# EasyEDA Pro project lceda_pro_3plus_2.5.epro, board pcb_main_4
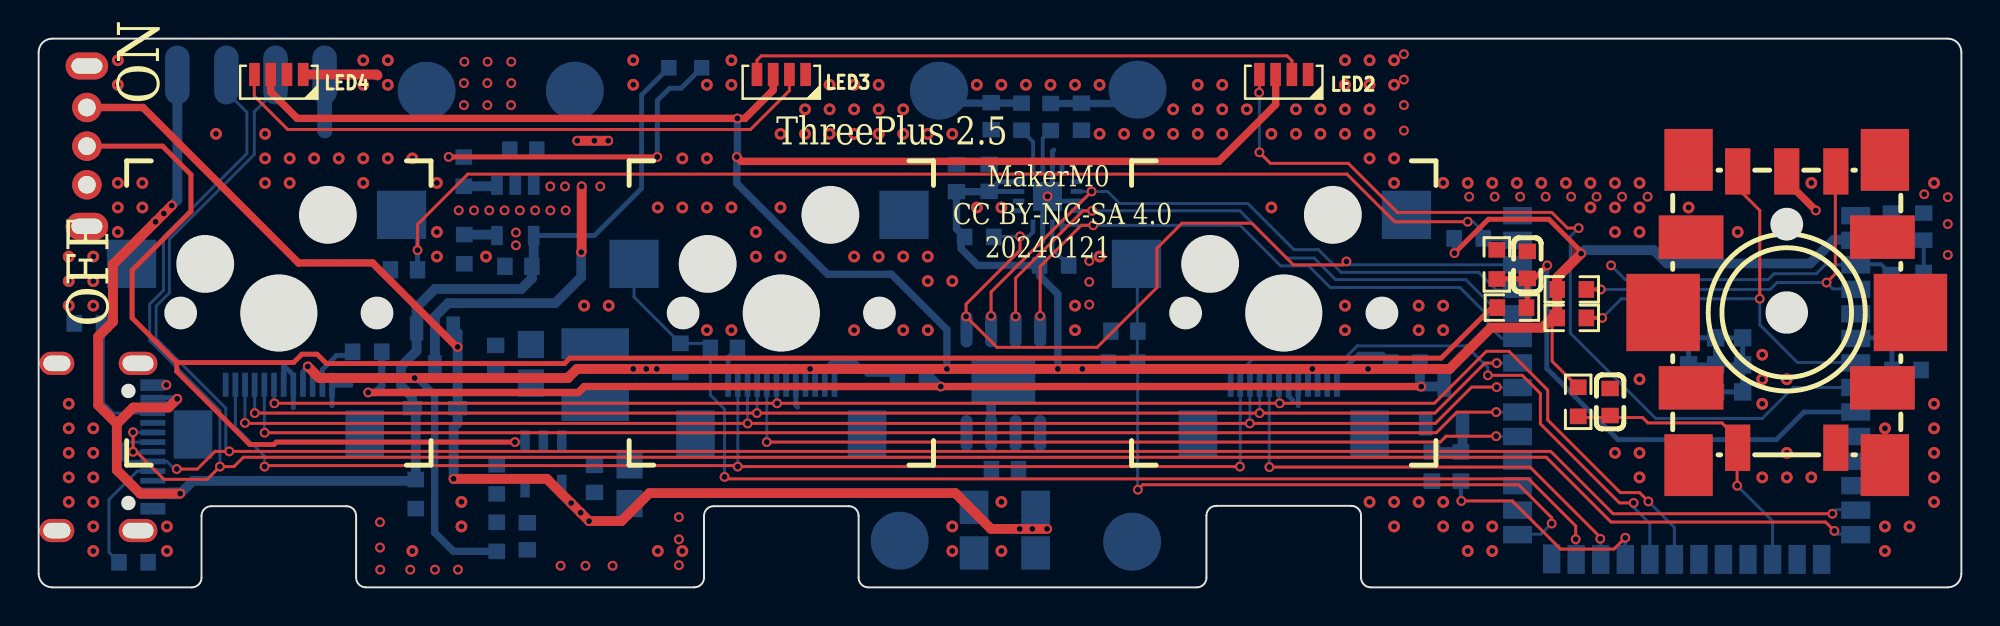
[diagram p1: board, top side]
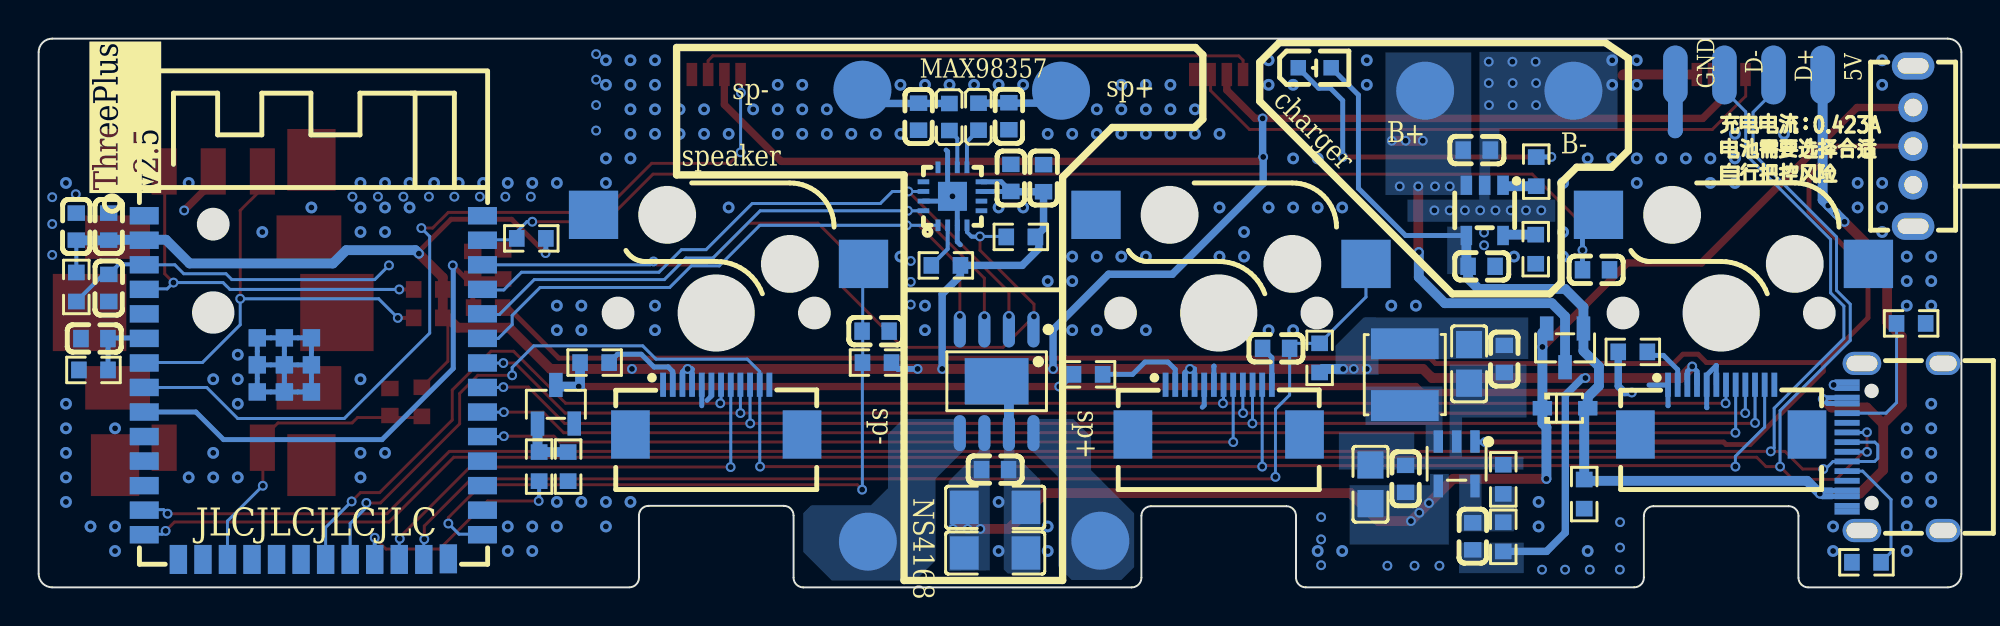
[diagram p2: board, bottom side, seen from below]

Outline 99.49 x 28.4 mm; copper layers: Top Layer, Bottom Layer. Coordinates in mm from the lower left corner of the outline.
Outline path: 0,27.7 arc(0.21,28.2) 0.7,28.4 98.79,28.4 arc(99.29,28.2) 99.49,27.7 99.49,0.7 arc(99.29,0.21) 98.79,0 68.93,0 arc(68.57,0.15) 68.43,0.5 68.43,3.72 arc(68.28,4.07) 67.93,4.22 60.93,4.22 arc(60.57,4.07) 60.43,3.72 60.43,0.5 arc(60.28,0.15) 59.93,0 42.93,0 arc(42.57,0.15) 42.43,0.5 42.43,3.7 arc(42.28,4.05) 41.93,4.2 34.93,4.2 arc(34.57,4.05) 34.43,3.7 34.43,0.5 arc(34.28,0.15) 33.93,0 16.93,0 arc(16.57,0.15) 16.43,0.5 16.43,3.7 arc(16.28,4.05) 15.93,4.2 8.93,4.2 arc(8.57,4.05) 8.43,3.7 8.43,0.5 arc(8.28,0.15) 7.93,0 0.7,0 arc(0.21,0.21) 0,0.7 0,27.7
Stack: Top Layer 0.035mm / Dielectric1 1.51mm FR4 er 4.5 / Bottom Layer 0.035mm

## Design rules (mm)
spacing safeClearance (default): track to track 0.152, other pairs 0.152 to 0.3
track width trackWidth (default): min 0.127, default 0.254, max 2.54
differential pair differentialPair (default): width min 0.127, default 0.254, max 2.54; gap min 0.152, default 0.152
via viaSize (default): diameter min 0.5, default 0.61, max 10; hole min 0.3, default 0.305, max 6

## Placement (name value [footprint] x y rotation side)
C4  100nF  [C0603]  95.87 18.67 270 bottom
C5  100nF  [C0603]  18.91 16.44 0 bottom
C6  10uF  [C0603]  97.54 18.67 270 bottom
C7  100nF  [C0603]  35.46 12.37 180 bottom
C8  100nF  [C0603]  56.18 13.26 0 bottom
C9  100nF  [C0603]  81.31 9.59 270 top
C10  10uF  [C0603]  25.08 22.63 0 bottom
C11  10uF  [C0603]  24.83 16.62 0 bottom
C34  10uF  [C0603]  47.49 21.18 270 bottom
C35  100nF  [C0603]  49.18 21.19 90 bottom
C47  680pF  [C0603]  49.29 24.39 90 bottom
C48  680pF  [C0603]  53.96 24.36 270 bottom
C204  1uF  [C0603]  95.86 15.5 90 bottom
C205  1uF  [C0603]  96.6 12.88 180 bottom
C206  100nF  [C0603]  28.76 5.62 270 bottom
C207  22uF  [C0805]  30.58 5.34 270 bottom
C208  22pF  [C0603]  25.28 2.64 270 bottom
C209  100nF  [C0603]  23.65 11.82 90 bottom
C210  22uF  [C0805]  25.47 11.57 90 bottom
C211  100nF  [C0603]  77.03 16.69 270 top
C213  1uF  [C0603]  50 6.1 0 bottom
C214  47uF  [C1206]  49.99 4.14 0 bottom
C215  47uF  [C1206]  49.99 1.78 0 bottom
D1  -  [sod-323_l1.8-w1.3-ls2.5-rd]  20.51 9.27 180 bottom
FPC1  FPC-05F-12PH20  [FPC-SMD_12P-P0.50_FPC-05F-12PH20]  12.43 9.2 180 bottom
FPC2  FPC-05F-12PH20  [FPC-SMD_12P-P0.50_FPC-05F-12PH20]  38.43 9.2 180 bottom
FPC3  FPC-05F-12PH20  [FPC-SMD_12P-P0.50_FPC-05F-12PH20]  64.43 9.2 180 bottom
L3  BLM18SG331TN1D  [L0603]  52.36 24.34 90 bottom
L4  BLM18SG331TN1D  [L0603]  50.86 24.36 90 bottom
L5  2.2uH  [IND-SMD_L4.0-W4.0]  28.8 11.01 270 bottom
LED1  -  [LED0603-R-RD]  33.46 26.89 180 bottom
LED2  XL-4020RGBC-WS2812B  [LED-SMD_4P-L4.0-W1.7_M4020-03003-RGB-862-001]  64.43 26.55 180 top
LED3  XL-4020RGBC-WS2812B  [LED-SMD_4P-L4.0-W1.7_M4020-03003-RGB-862-001]  38.43 26.55 180 top
LED4  XL-4020RGBC-WS2812B  [LED-SMD_4P-L4.0-W1.7_M4020-03003-RGB-862-001]  12.43 26.55 180 top
MX1  CPG151101S11-16  [CherryMX(KHS)-1.00U]  12.43 14.2 0 top
MX2  CPG151101S11-16  [CherryMX(KHS)-1.00U]  38.43 14.2 0 top
MX3  CPG151101S11-16  [CherryMX(KHS)-1.00U]  64.43 14.2 0 top
NOREF  -  [Pad_e276]  44.55 2.41 0 top
NOREF#2  -  [Pad_e277]  56.58 2.36 0 top
NOREF#3  -  [Pad_e3529]  20.07 25.71 270 top
NOREF#4  -  [Pad_e413]  7.18 26.52 0 top
NOREF#5  -  [Pad_e11]  12.26 26.52 0 top
NOREF#6  -  [Pad_e411]  9.72 26.52 0 top
NOREF#7  -  [Pad_e14]  14.8 26.52 0 top
NOREF#8  -  [Pad_e1487]  56.86 25.76 0 top
NOREF#9  -  [Pad_e1486]  46.59 25.71 0 top
NOREF#10  -  [Pad_e3530]  27.74 25.71 270 top
Q1  -  [SOT-23-3_L2.9-W1.3-P1.90-LS2.4-BR]  20.51 12.4 90 bottom
Q200  -  [SOT-23-3_L2.9-W1.3-P1.90-LS2.4-BR]  72.73 9.48 270 bottom
R1  5.1kΩ  [R0603]  4.91 1.3 0 bottom
R2  5.1kΩ  [R0603]  2.6 13.66 180 bottom
R3  10kΩ  [R0603]  74 18.06 180 bottom
R5  10kΩ  [R0603]  97.54 15.55 90 bottom
R7  10kΩ  [R0603]  33.21 11.88 270 bottom
R8  10kΩ  [R0603]  56.11 11.63 180 bottom
R9  10kΩ  [R0603]  79.33 13.95 0 top
R10  10kΩ  [R0603]  79.33 15.42 0 top
R11  10kΩ  [R0603]  79.66 9.6 90 top
R13  100kΩ  [R0603]  19.51 4.83 270 bottom
R16  1kΩ  [R0603]  22 21.52 90 bottom
R42  634kΩ  [R0603]  48.67 18.14 180 bottom
R43  100kΩ  [R0603]  52.55 16.66 180 bottom
R201  1kΩ  [R0603]  73.59 6.25 90 bottom
R202  10kΩ  [R0603]  72.09 6.25 90 bottom
R204  1MΩ  [R0603]  96.65 11.25 180 bottom
R205  20Ω  [R0603]  17 12.19 180 bottom
R206  20Ω  [R0603]  45.19 11.03 180 bottom
R207  20Ω  [R0603]  70.72 11.63 180 bottom
R208  1.5kΩ  [R0603]  22.02 17.5 90 bottom
R209  100kΩ  [R0603]  23.7 2.62 270 bottom
R211  22.1kΩ  [R0603]  23.7 5.59 270 bottom
R214  100kΩ  [R0603]  76.23 14.48 180 top
R215  100kΩ  [R0603]  75.45 16.72 270 top
SW102  EC11J1524413  [SW-SMD_EC11J1524413]  90.46 14.23 180 top
SW111  SK12D07VG4  [SW-TH_SK12D07VG4]  2.5 22.84 90 bottom
U1  -  [sot-23-5_l3.0-w1.7-p0.95-ls2.8-br]  24.67 19.51 90 bottom
U15  MAX98357AETE+T  [TQFN-16_L3.0-W3.0-P0.50-BL-EP1.5]  52.21 20.24 180 bottom
U205  ESP32-S3-WROOM-1-N8R2  [WIRELM-SMD_ESP32-S3-WROOM-1]  85.28 10.34 180 bottom
U206  SY8088IAAC  [SOT-23-5_L3.0-W1.7-P0.95-LS2.8-BL]  26.12 6.4 0 bottom
U207  NS4168  [ESOP-8_L4.9-W3.9-P1.27-LS6.0-BL-EP-1]  49.92 10.67 0 bottom
USB2  -  [USB-C_SMD-TYPE-C-31-M-12]  3.43 7.27 90 bottom

## Footprints (pads in the part's own frame, mm; a bottom-side part is the same pattern mirrored in y, then rotated)
C0603
  rect 0.8x0.9 smd: 1(-0.7,0) 2(0.7,0)
C0805
  rect 1.41x1.35 smd: 1(-1,0) 2(1,0)
C1206
  rect 1.485x1.728 smd: 1(-1.593,0) 2(1.593,0)
CherryMX(KHS)-1.00U
  rect 2.55x2.499 smd far side: COL(-7.62,2.54) ROW(6.35,5.08)
ESOP-8_L4.9-W3.9-P1.27-LS6.0-BL-EP-1
  oval 0.63x1.865 smd: 1(-1.905,-2.683) 2(-0.635,-2.683) 3(0.635,-2.683) 4(1.905,-2.683) 5(1.905,2.683) 6(0.635,2.683) 7(-0.635,2.683) 8(-1.905,2.683)
  rect 3.3x2.4 smd: 9(0,0)
FPC-SMD_12P-P0.50_FPC-05F-12PH20
  rect 0.3x1.25 smd: 1(-2.75,1.288) 2(-2.25,1.288) 3(-1.75,1.288) 4(-1.25,1.288) 5(-0.75,1.288) 6(-0.25,1.288) 7(0.25,1.288) 8(0.75,1.288) 9(1.25,1.288) 10(1.75,1.288) 11(2.25,1.288) 12(2.75,1.288)
  rect 2x2.5 smd: 13(4.44,-1.288) 14(-4.44,-1.288)
IND-SMD_L4.0-W4.0
  rect 1.6x3.5 smd: 1(-1.6,0) 2(1.6,0)
L0603
  rect 0.8x0.864 smd: 1(-0.7,0) 2(0.7,0)
LED0603-R-RD
  rect 0.8x0.8 smd: 1(0.851,0) 2(-0.851,0)
LED-SMD_4P-L4.0-W1.7_M4020-03003-RGB-862-001
  rect 0.55x1.2 smd: 1(-1.26,0) 2(-0.42,0) 3(0.42,0) 4(1.26,0)
Pad_e11
  oval 1.27x3.048 smd far side: 43(0,0)
Pad_e14
  oval 1.27x3.048 smd far side: 44(0,0)
Pad_e276
  round 3 smd far side: 1(0,0)
Pad_e277
  round 3 smd far side: 2(0,0)
Pad_e411
  oval 1.27x3.048 smd far side: 43(0,0)
Pad_e413
  oval 1.27x3.048 smd far side: 42(0,0)
Pad_e1486
  round 3 smd far side: 1(0,0)
Pad_e1487
  round 3 smd far side: 2(0,0)
Pad_e3529
  round 3 smd far side: 1(0,0)
Pad_e3530
  round 3 smd far side: 2(0,0)
R0603
  rect 0.806x0.864 smd: 1(-0.753,0) 2(0.753,0)
sod-323_l1.8-w1.3-ls2.5-rd
  rect 1.001x0.75 smd: 1(-1.173,0) 2(1.173,0)
SOT-23-3_L2.9-W1.3-P1.90-LS2.4-BR
  rect 1.25x0.701 smd: 1(1.001,-0.95) 2(1.001,0.95) 3(-1.001,0)
SOT-23-5_L3.0-W1.7-P0.95-LS2.8-BL
  rect 0.49x1.157 smd: 1(-0.95,-1.153) 2(0,-1.153) 3(0.95,-1.153)
  rect 0.49x1.175 smd: 4(0.95,1.153) 5(-0.95,1.153)
sot-23-5_l3.0-w1.7-p0.95-ls2.8-br
  rect 1.001x0.6 smd: 1(1.3,-0.95) 2(1.3,0) 3(1.3,0.95) 4(-1.3,0.95) 5(-1.3,-0.95)
SW-SMD_EC11J1524413
  rect 1.3x2.4 smd: A(-2.54,-7.3) B(2.54,-7.3) C(0,-7.3) D(-2.54,7) E(2.54,7)
  rect 3.8x4 smd: EH(-6.4,0) EH(6.4,0)
  rect 2.5x3.2 smd: EH(-5.08,7.9) EH(-5.08,-7.9) EH(5.08,7.9) EH(5.08,-7.9)
  rect 3.35x2.25 smd: EH(-4.95,3.9) EH(-4.95,-3.9) EH(4.95,3.9) EH(4.95,-3.9)
SW-TH_SK12D07VG4
  round 1.524 hole 0.914: 1(-2,0) 2(0,0) 3(2,0)
  oval 1.4x2.2 hole 0.8x1.6: 4(4.15,0) 5(-4.15,0)
TQFN-16_L3.0-W3.0-P0.50-BL-EP1.5
  rect 0.25x0.6 smd: 1(-0.749,-1.5) 2(-0.248,-1.5) 3(0.252,-1.5) 4(0.751,-1.5) 9(0.75,1.5) 10(0.25,1.5) 11(-0.25,1.5) 12(-0.749,1.5)
  rect 0.6x0.25 smd: 5(1.5,-0.748) 6(1.5,-0.248) 7(1.5,0.252) 8(1.5,0.752) 13(-1.5,0.752) 14(-1.5,0.252) 15(-1.5,-0.248) 16(-1.5,-0.748)
  rect 1.5x1.5 smd: 17(0,0)
USB-C_SMD-TYPE-C-31-M-12
  oval 1.2x1.8 hole 0.8x1.4: 0(-4.325,-2.484) 0(4.325,-2.484)
  oval 1.2x2 hole 0.8x1.6: 0(-4.325,1.716) 0(4.325,1.716)
  rect 0.3x1.3 smd: A1(-3.35,2.484) A4(-2.55,2.484) A5(-1.25,2.484) A6(-0.25,2.484) A7(0.25,2.484) A8(1.25,2.484) A9(2.55,2.484) A12(3.35,2.484) B1(3.05,2.484) B4(2.25,2.484) B5(1.75,2.484) B6(0.75,2.484) B7(-0.75,2.484) B8(-1.75,2.484) B9(-2.25,2.484) B12(-3.05,2.484)
WIRELM-SMD_ESP32-S3-WROOM-1
  rect 1.5x0.9 smd: 1(-8.75,8.895) 2(-8.75,7.625) 3(-8.75,6.355) 4(-8.75,5.085) 5(-8.75,3.815) 6(-8.75,2.545) 7(-8.75,1.275) 8(-8.75,0.005) 9(-8.75,-1.265) 10(-8.75,-2.535) 11(-8.75,-3.805) 12(-8.75,-5.075) 13(-8.75,-6.345) 14(-8.75,-7.615) 27(8.75,-7.615) 28(8.75,-6.345) 29(8.75,-5.075) 30(8.75,-3.805) 31(8.75,-2.535) 32(8.75,-1.265) 33(8.75,0.005) 34(8.75,1.275) 35(8.75,2.545) 36(8.75,3.815) 37(8.75,5.085) 38(8.75,6.355) 39(8.75,7.625) 40(8.75,8.895)
  rect 0.9x1.5 smd: 15(-6.985,-8.895) 16(-5.715,-8.895) 17(-4.445,-8.895) 18(-3.175,-8.895) 19(-1.905,-8.895) 20(-0.635,-8.895) 21(0.635,-8.895) 22(1.905,-8.895) 23(3.175,-8.895) 24(4.445,-8.895) 25(5.715,-8.895) 26(6.985,-8.865)
  rect 0.9x0.9 smd: 41(-2.9,-0.225) 41(-2.9,1.175) 41(-2.9,2.575) 41(-1.5,-0.225) 41(-1.5,1.175) 41(-1.5,2.575) 41(-0.1,-0.225) 41(-0.1,1.175) 41(-0.1,2.575)

## Nets
As in the schematic, except:
GND: C4.1 C5.1 C6.1 C7.1 C8.1 C9.1 C10.1 C11.1 C34.1 C35.2 C47.1 C48.2 C204.1 C205.1 C206.1 C207.1 C209.1 C210.1 C211.1 C213.1 C214.1 C215.1 FPC1.1 FPC1.5 FPC1.6 FPC1.12 FPC1.13 FPC1.14 FPC2.1 FPC2.5 FPC2.6 FPC2.12 FPC2.13 FPC2.14 FPC3.1 FPC3.5 FPC3.6 FPC3.12 FPC3.13 FPC3.14 LED2.1 LED3.1 LED4.1 MX1.COL MX2.ROW MX3.ROW NOREF#3.1 NOREF#7.44 Q200.2 R1.2 R2.2 R13.2 R202.1 R204.1 R208.1 R211.1 R215.1 SW102.C SW102.D SW102.EH SW111.1 SW111.4 SW111.5 U1.2 U15.3 U15.11 U15.15 U15.17 U205.1 U205.40 U205.41 U206.2 U207.7 U207.9 USB2.0 USB2.A1 USB2.A12 USB2.B1 USB2.B12
VBAT: C10.2 NOREF#10.2 Q1.3 U1.3
NS_N: NOREF#2.2 U207.5
NS_P: NOREF.1 U207.8
USBDM: NOREF#5.43 U205.13 USB2.A7 USB2.B7
USBDP: NOREF#6.43 U205.14 USB2.A6 USB2.B6
VON: C48.1 L3.2 NOREF#8.2
VOP: C47.2 L4.2 NOREF#9.1
VUSB: C11.2 D1.2 LED1.1 NOREF#4.42 Q1.1 R13.1 U1.4 USB2.A4 USB2.A9 USB2.B4 USB2.B9

Pads without a net: U15 5 6 12 13; U205 5 10 11 12 15 16 18 19 20 26 28 29 30; USB2 A8 B8

## Via types
v1: diameter 0.508, hole 0.305, Top Layer to Bottom Layer, 152 vias
v2: diameter 0.61, hole 0.305, Top Layer to Bottom Layer, 196 vias

## Routing (per net, layer and track width the routed paths; a pad name or vN(x,y) marks a point on that pad's centre or on a via; arc(x,y) is an arc through that point)
GND: length 47.3
  Top Layer w0.381: 90.43,21.5 90.43,21.04 v1(91.96,19.51)
  Top Layer w0.508: 17.53,26.49 17.48,26.55 LED4.1
  Bottom Layer w0.254: U15.15 52.45,19.99 ; 39.18,10.47 39.18,9.42 39.28,9.32 ; U205.41 U205.41 U205.41 ; U205.41 U205.41 ; U205.41 U205.41 U205.41 ; U205.41 U205.41 ; U205.41 U205.41 ; U205.41 U205.41 ; 51.8,17.73 51.95,17.89 U15.3 51.95,19.99 v1(52.21,20.24) 52.46,20.49 U15.11 52.46,22.55 52.53,22.63 ; U205.41 U205.41 U205.41 ; U205.41 U205.41 U205.41 ; 15.17,9.4 15.18,9.41 15.18,10.47 16.16,10.47 ; C7.1 35.68,11.89 35.68,10.49 ; 64.9,9.68 64.68,9.91 64.68,10.47 ; 38.68,10.47 38.68,11.45 38.67,11.46 ; 65.18,10.47 65.18,9.4 ; 13.16,9.3 13.18,9.31 13.18,10.99 12.68,11.48 12.68,11.48 12.68,10.47
  Bottom Layer w0.508: U207.7 49.28,10.03 U207.9
  Bottom Layer w0.762: 14.82,23.62 14.8,23.64 NOREF#7.44
  vias: v1(6.61,10.48) v1(17.66,3.37) v1(17.66,2.06) v1(17.67,0.92) v1(19.23,0.92) v1(20.51,0.92) v1(21.7,0.92) v1(21.74,19.51) v1(22.01,26.1) v1(22.01,24.96) v1(22.03,27.21) v1(22.53,19.51) v1(23.23,27.21) v1(23.22,26.1) v1(23.22,24.96) v1(23.32,19.51) v1(24.11,19.51) v1(24.45,27.21) v1(24.45,26.1) v1(24.44,24.96) v1(24.7,18.37) v1(24.7,17.71) v1(24.9,19.51) v1(25.69,19.51) v1(26.48,19.51) v1(27.01,1.12) v1(27.27,19.51) v1(28.29,1.12) v1(29.7,1.12) v1(33.13,3.63) v1(33.13,2.48) v1(33.13,1.14) v1(54.36,16.89) v1(54.36,15.81) v1(54.36,14.64) v1(70.65,27.6) v1(70.65,26.28) v1(70.65,24.96) v1(70.65,23.64) v1(74.02,20.22) v1(75.34,20.22) v1(76.66,20.22) v1(77.98,20.22) v1(79.3,20.22) v1(80.62,20.22) v1(81.93,20.22) v1(83.25,20.22) v1(97.57,20.35) v1(98.79,20.19) v1(98.79,18.8) v1(98.79,17.21) v2(1.56,17.12) v2(1.56,15.85) v2(1.56,14.58) v2(1.56,9.5) v2(1.56,8.23) v2(1.56,6.96) v2(1.56,5.69) v2(1.56,4.42) v2(2.83,17.12) v2(2.83,15.85) v2(2.83,14.58) v2(2.83,8.23) v2(2.83,6.96) v2(2.83,5.69) v2(2.83,4.42) v2(2.83,3.15) v2(2.83,1.88) v2(4.1,27.28) v2(4.1,26.01) v2(4.1,20.93) v2(4.1,19.66) v2(4.1,18.39) v2(5.37,20.93) v2(5.37,19.66) v2(6.64,3.15) v2(6.64,1.88) v2(9.18,23.47) v2(11.72,23.47) v2(11.72,22.2) v2(11.72,20.93) v2(12.99,22.2) v2(12.99,20.93) v2(14.26,22.2) v2(15.53,22.2) v2(16.8,27.28) v2(16.8,26.01) v2(16.8,22.2) v2(16.8,20.93) v2(18.07,27.28) v2(18.07,26.01) v2(18.07,22.2) v2(19.34,22.2) v2(19.34,1.88) v2(20.61,20.93) v2(20.61,18.39) v2(20.61,17.12) v2(21.88,4.42) v2(21.88,3.15) v2(23.15,17.12) v2(28.23,14.58) v2(29.5,14.58) v2(30.77,27.28) v2(30.77,26.01) v2(32.04,19.66) v2(32.04,1.88) v2(33.31,22.2) v2(33.31,19.66) v2(33.31,1.88) v2(34.58,26.01) v2(34.58,22.2) v2(34.58,19.66) v2(34.58,13.31) v2(35.85,27.28) v2(35.85,26.01) v2(35.85,19.66) v2(35.85,13.31) v2(37.12,18.39) v2(37.12,17.12) v2(38.39,23.47) v2(38.39,19.66) v2(38.39,17.12) v2(39.66,24.74) v2(39.66,23.47) v2(40.93,26.01) v2(40.93,24.74) v2(40.93,23.47) v2(42.2,26.01) v2(42.2,24.74) v2(42.2,23.47) v2(42.2,17.12) v2(42.2,13.31) v2(43.47,26.01) v2(43.47,24.74) v2(43.47,23.47) v2(43.47,17.12) v2(44.74,24.74) v2(44.74,23.47) v2(44.74,17.12) v2(44.74,13.31) v2(46.01,23.47) v2(46.01,17.12) v2(46.01,15.85) v2(46.01,13.31) v2(47.28,23.47) v2(47.28,15.85) v2(47.28,3.15) v2(47.28,1.88) v2(48.55,26.01) v2(48.55,19.66) v2(49.82,26.01) v2(49.82,19.66) v2(49.82,4.42) v2(49.82,1.88) v2(51.09,26.01) v2(52.36,26.01) v2(53.63,26.01) v2(53.63,14.58) v2(53.63,13.31) v2(54.9,26.01) v2(54.9,23.47) v2(54.9,17.12) v2(56.17,23.47) v2(57.44,23.47) v2(58.71,24.74) v2(58.71,23.47) v2(59.98,26.01) v2(59.98,24.74) v2(59.98,23.47) v2(61.25,26.01) v2(61.25,24.74) v2(61.25,23.47) v2(62.52,24.74) v2(63.79,23.47) v2(63.79,19.66) v2(65.06,24.74) v2(65.06,23.47) v2(66.33,24.74) v2(66.33,23.47) v2(67.6,27.28) v2(67.6,26.01) v2(67.6,24.74) v2(67.6,23.47) v2(67.6,14.58) v2(67.6,13.31) v2(68.87,27.28) v2(68.87,26.01) v2(68.87,24.74) v2(68.87,23.47) v2(68.87,22.2) v2(68.87,4.42) v2(70.14,27.28) v2(70.14,26.01) v2(70.14,22.2) v2(70.14,20.93) v2(70.14,4.42) v2(70.14,3.15) v2(71.41,14.58) v2(71.41,13.31) v2(71.41,4.42) v2(72.68,20.93) v2(72.68,14.58) v2(72.68,13.31) v2(72.68,4.42) v2(72.68,3.15) v2(73.95,20.93) v2(73.95,3.15) v2(73.95,1.88) v2(75.22,20.93) v2(75.22,3.15) v2(75.22,1.88) v2(76.49,20.93) v2(77.76,20.93) v2(79.03,20.93) v2(80.3,20.93) v2(80.3,19.66) v2(81.57,20.93) v2(81.57,19.66) v2(81.57,18.39) v2(81.57,6.96) v2(82.84,20.93) v2(82.84,19.66) v2(82.84,18.39) v2(82.84,10.77) v2(82.84,6.96) v2(82.84,5.69) v2(85.38,19.66) v2(87.92,18.39) v2(89.19,12.04) v2(89.19,10.77) v2(89.19,9.5) v2(89.19,5.69) v2(90.46,10.77) v2(90.46,6.96) v2(90.46,5.69) v2(91.73,20.93) v2(91.73,5.69) v2(95.54,8.23) v2(95.54,3.15) v2(95.54,1.88) v2(96.81,3.15) v2(98.08,20.93) v2(98.08,9.5) v2(98.08,8.23) v2(98.08,6.96) v2(98.08,5.69) v2(98.08,4.42)
VBAT: length 17.3
  Top Layer w0.508: v1(27.87,23.12) v1(28.76,23.12) v1(29.47,23.12) ; v1(28.1,20.75) 28.1,17.38 v1(28.07,17.35)
  Bottom Layer w0.508: 20.51,11.44 20.51,14.02 21.19,14.71 26.73,14.71 28.07,16.05 v1(28.07,17.35)
  vias: v1(26.47,20.75) v1(27.24,20.75) v1(29.06,20.75)
VCC: length 222.6
  Top Layer w0.152: R11.2 78.32,11.7 78.32,13.95 78.58,14.21
  Top Layer w0.254: v1(79.81,17.27) 79.81,17.38 78.15,19.05 75.01,19.05 v1(73.26,17.3)
  Top Layer w0.381: LED2.3 64.01,24.99 61.07,22.05 36.35,22.05 v1(36.13,22.28) ; LED3.3 38.01,25.73 36.55,24.27 v1(36.16,24.27) 13.38,24.27 12.01,25.64 LED4.3
  Top Layer w0.508: 27.39,10.84 v1(19.45,10.84) 14.52,10.84 v1(13.93,11.43) ; 27.39,10.84 27.39,10.88 ; 27.39,10.84 27.86,11.3 v1(30.77,11.3) v1(31.44,11.3) v1(31.99,11.3) v1(39.92,11.3) v1(47,11.3) v1(52.74,11.3) v1(54.01,11.3) v1(65.91,11.3) v1(68.79,11.3) 73.01,11.3 75.14,13.44 77.81,13.44 78.32,13.95 R9.1 R10.1 78.58,16.04 v1(79.81,17.27)
  Bottom Layer w0.203: 97.54,17.96 R5.2
  Bottom Layer w0.254: 66.18,10.47 66.18,11.15 66.05,11.28 65.69,11.28 65.68,11.29 ; U15.7 49.19,20.49 C35.1 49.68,20.99 U15.8 ; 13.68,10.47 13.68,11.18 v1(13.93,11.43) 14.18,11.18 14.18,10.47 ; R3.2 73.24,17.32 v1(73.26,17.3) ; 39.68,10.47 39.68,10.47 39.68,11.3 39.99,11.3 40.18,11.11 40.18,10.47 ; 65.68,11.29 65.68,10.47 ; 65.68,11.29 65.69,11.3 v1(65.91,11.3)
  Bottom Layer w0.305: v1(54.01,11.3) 55.03,11.3 R8.2
  Bottom Layer w0.381: R209.2 21.46,1.86 20.49,2.83 20.49,9.95 19.6,10.84 v1(19.45,10.84) ; 47.73,18.32 47.73,17.53 48.6,16.66 R43.2 51.79,16.13 52.74,15.18 v1(52.74,11.3) ; 47.73,18.32 R42.2 ; 47.73,18.32 47.49,18.56 C34.2 49.17,20.48 C35.1 ; v1(36.16,24.27) 36.16,22.31 v1(36.13,22.28) 36.13,20.91 40.83,16.21 44.13,16.21 47,13.34 v1(47,11.3)
  Bottom Layer w0.508: 97.54,17.96 95.75,17.96 95.72,17.99 92.9,17.99 91.68,16.77 84.26,16.77 83.57,17.45 79.99,17.45 v1(79.81,17.27) ; v1(31.99,11.3) 33.03,11.3 R7.2
ADC: length 27.9
  Top Layer w0.254: C211.2 77.03,14.52 R214.1 ; C211.2 77.01,15.97 75.46,15.97 R215.2 ; C211.2 77.39,15.99 v1(78.06,16.66)
  Bottom Layer w0.254: U205.9 91.35,9.08 89.92,7.65 81.72,7.65 78.04,11.33 78.04,16.64 v1(78.06,16.66)
AUDIO_SD: length 42.4
  Top Layer w0.152: v1(50.78,18.16) 50.78,17.45 47.99,14.66 v1(47.99,14.02) 49.59,12.42 54.77,12.42 57.87,15.52 57.87,17.55 59.16,18.85 62.77,18.85 64.93,16.69 67.5,16.69 v1(67.67,16.87)
  Bottom Layer w0.152: U205.38 67.85,16.69 v1(67.67,16.87) ; 51.23,18.16 51.2,18.14 50.76,18.14 v1(50.78,18.16) 49.45,18.16 R42.1
  Bottom Layer w0.203: U15.4 51.45,18.39 51.23,18.16 50.76,18.14
BOOT: length 36.2
  Top Layer w0.152: v1(78.29,3.3) 78.29,3.61 76.59,5.31 57.13,5.31 v1(56.88,5.06)
  Bottom Layer w0.152: v1(78.29,3.3) 77.74,2.75 76.53,2.75 ; MX3.COL 56.85,16.7 56.85,11.78 56.87,11.76 56.87,5.07 v1(56.88,5.06)
CC1: length 6.8
  Bottom Layer w0.152: R1.1 3.64,1.81 3.64,4.55 5.11,6.02 6.33,6.02
CC2: length 7.3
  Bottom Layer w0.152: 6.33,9.02 3.9,9.02 3.35,9.56 R2.1
EC_A: length 20.1
  Top Layer w0.152: v1(92.51,15.78) 92.97,16.23 92.97,21.5
  Top Layer w0.203: R10.2 v1(80.83,15.42)
  Bottom Layer w0.152: v1(80.83,15.42) 89.59,15.42 89.95,15.78 v1(92.51,15.78) 92.84,15.45 94.03,15.45
EC_B: length 23.6
  Top Layer w0.152: v1(89.06,14.94) 89.06,19.51 87.89,20.68 87.89,21.5
  Top Layer w0.203: R9.2 v1(80.91,13.95)
  Bottom Layer w0.152: v1(80.91,13.95) 81.9,14.94 v1(89.06,14.94) 89.06,13.59 91.01,11.64 94.03,11.64
EN: length 17.6
  Bottom Layer w0.152: v1(81.36,16.66) 82.1,15.93 89.49,15.93 89.8,16.23 91.98,16.23 92.44,16.69 U205.3
  Bottom Layer w0.203: 94.03,16.72 95.34,16.72 C204.2 96.14,16.2 R5.1
I2S_BCK: length 32.4
  Top Layer w0.152: v1(54.51,19.49) 54.04,19.49 50.55,16 v1(50.55,14.02)
  Bottom Layer w0.152: U15.16 v1(54.51,19.49) 62.15,19.49 64.6,17.05 66,17.05 67.11,15.93 73.85,15.93 75.65,14.12 76.5,14.12 U205.36
I2S_DATA: length 32.5
  Top Layer w0.152: v1(54.57,18.74) 53.95,18.74 51.82,16.61 v1(51.82,14.05)
  Bottom Layer w0.152: U205.35 75.7,12.88 74.99,13.6 74.99,14.07 73.54,15.52 66.84,15.52 65.72,16.64 64.27,16.64 62.17,18.74 v1(54.57,18.74) U15.1
I2S_WS: length 33.5
  Top Layer w0.152: v1(54.49,20.49) 49.28,15.29 v1(49.28,14.05)
  Bottom Layer w0.152: U15.14 v1(54.49,20.49) 55.31,20.49 55.94,19.86 62.57,19.86 64.96,17.48 66.23,17.48 67.39,16.31 74.51,16.31 75.42,15.39 76.5,15.39 U205.37
IO6: length 3.5
  Bottom Layer w0.254: 94.03,12.91 95.87,12.91 C205.2 95.9,12.88 R204.2
IO13: length 82.8
  Top Layer w0.152: v1(12.2,9.53) v1(38.21,9.53) v1(64.22,9.53) 72.22,9.53 74.91,12.22 76.08,12.22 78.09,10.21 78.09,8.66 81.85,4.9 82.84,4.9 v1(83.29,4.45)
  Bottom Layer w0.152: v1(83.29,4.45) 84.64,3.1 U205.21 ; 64.18,10.47 64.18,9.57 v1(64.22,9.53) ; v1(12.2,9.53) 12.18,9.55 12.18,10.47 ; v1(38.21,9.53) 38.18,9.56 38.18,10.47
IO14: length 93.2
  Top Layer w0.152: v1(11.69,6.25) 11.74,6.3 36.13,6.3 v1(36.18,6.25) v1(62.16,6.25) ; v1(82.53,4.37) 81.8,4.37 77.71,8.46 77.71,10.03 76.77,10.97 v1(74.99,10.97)
  Bottom Layer w0.152: 10.18,10.47 10.18,8.3 11.69,6.78 v1(11.69,6.25) ; 36.18,6.25 36.18,10.47 ; v1(62.16,6.25) 62.18,6.27 62.18,11.17 62.82,11.81 67.55,11.81 68.23,12.5 73.87,12.5 74.99,11.38 v1(74.99,10.97) ; U205.22 83.37,3.3 82.53,4.14 v1(82.53,4.37)
LCD_BL: length 11.9
  Top Layer w0.152: v1(82.1,2.57) 81.52,1.98 78.75,1.98 76.26,4.47 v1(73.62,4.47)
  Bottom Layer w0.203: v1(73.62,4.47) 73.59,4.5 R201.1 ; U205.23 v1(82.1,2.57)
LED: length 45.1
  Top Layer w0.152: v1(63.17,22.52) 63.74,21.95 67.77,21.95 70.31,19.41 78.29,19.41 79.11,18.59 v1(79.69,18.59) ; LED2.4 63.17,25.62 v1(63.15,25.6)
  Bottom Layer w0.152: v1(63.17,22.52) 63.17,25.59 v1(63.15,25.6) ; U205.8 90.79,10.34 89.19,8.74 83.67,8.74 79.26,13.16 79.26,18.16 v1(79.69,18.59)
LEDK: length 60.8
  Top Layer w0.381: v1(71.54,10.39) v1(46.68,10.39) 28.23,10.39 27.92,10.09 v1(17.05,10.09)
  Bottom Layer w0.254: 72.64,10.39 Q200.3
  Bottom Layer w0.381: R205.1 17.75,10.41 17.42,10.09 v1(17.05,10.09) ; v1(46.68,10.39) 46.05,11.03 R206.1
  Bottom Layer w0.508: R207.1 71.47,10.39 v1(71.54,10.39) 72.64,10.39
MOSI: length 72.6
  Top Layer w0.152: v1(10.68,8.51) 10.7,8.49 v1(36.69,8.49) v1(62.67,8.49) 72.27,8.49 74.15,10.36 v1(75.45,10.36)
  Bottom Layer w0.152: 10.68,10.47 10.68,10.47 v1(10.68,8.51) 10.68,8.46 ; 62.68,10.47 62.68,8.49 v1(62.67,8.49) ; U205.33 75.47,10.34 v1(75.45,10.36) ; v1(36.69,8.49) 36.68,8.49 36.68,10.47
OLED_CS1: length 67.8
  Top Layer w0.152: v1(11.69,8) 72.32,8 73.39,9.07 v1(75.42,9.07)
  Bottom Layer w0.152: v1(11.69,8) 11.68,8.02 11.68,10.47 ; U205.32 76.52,9.07 v1(75.42,9.07)
OLED_CS2: length 41.9
  Top Layer w0.152: v1(37.68,7.52) 72.52,7.52 72.83,7.83 v1(75.42,7.83)
  Bottom Layer w0.152: 37.68,10.47 37.68,7.52 v1(37.68,7.52) ; U205.31 75.44,7.8 v1(75.42,7.83)
OLED_CS3: length 24
  Top Layer w0.152: v1(63.69,6.22) 77.17,6.22 80.81,2.59 v1(80.81,2.52)
  Bottom Layer w0.152: v1(80.81,2.52) 80.83,2.49 U205.24 ; 63.68,10.47 63.68,6.23 v1(63.69,6.22)
SCLK: length 70.8
  Top Layer w0.152: v1(75.45,11.61) 74.84,11.61 72.25,9.02 v1(63.18,9.02) v1(37.17,9.02) v1(11.18,9.02)
  Bottom Layer w0.152: v1(11.18,9.02) 11.18,9.02 11.18,10.47 ; v1(75.45,11.61) 76.52,11.61 U205.34 ; 63.18,9.02 63.18,10.47 ; v1(37.17,9.02) 37.18,9.03 37.18,10.47
SW01: length 64.1
  Top Layer w0.152: v1(73.95,18.92) 70.16,18.92 67.7,21.39 22.21,21.39 19.6,18.79 v1(19.6,17.45)
  Bottom Layer w0.152: 76.53,17.99 74.82,17.99 R3.1 74.75,18.4 74.23,18.92 v1(73.95,18.92)
  Bottom Layer w0.254: MX1.ROW 19.6,18.45 v1(19.6,17.45) C5.2
SW02: length 60.6
  Top Layer w0.152: v1(35.49,5.72) 35.59,5.62 77.1,5.62 79.53,3.18 v1(79.53,2.49)
  Bottom Layer w0.152: MX2.COL 30.81,15.03 R7.1 34.5,12.63 C7.2 34.76,9.95 35.49,9.22 v1(35.49,5.72) ; U205.25 79.56,2.47 v1(79.53,2.49)
SW04: length 16.2
  Top Layer w0.152: 87.89,7.73 87.92,7.7 SW102.E ; 87.89,7.73 87.89,5.26 v1(87.89,5.26) ; 87.89,7.73 87.1,8.51 83.27,8.51 82.99,8.79 79.72,8.79 R11.1
  Bottom Layer w0.152: 89.72,1.47 89.72,3.43 v1(87.89,5.26)
USBDM: length 117.9
  Top Layer w0.152: v1(7.14,6.12) 8.21,6.12 9.13,7.04 v1(9.86,7.04) 78.24,7.04 81.47,3.81 v1(92.82,3.81)
  Bottom Layer w0.152: NOREF#5.43 12.26,25.71 11.16,24.61 11.16,22.41 6.76,18.01 6.76,15.24 6.08,14.56 6.08,12.88 9.69,9.27 9.69,7.22 v1(9.86,7.04) ; USB2.A7 4.48,7.52 4.33,7.36 4.33,6.68 4.49,6.52 USB2.B7 6.64,6.52 7.03,6.12 v1(7.14,6.12) ; v1(92.82,3.81) 93.03,4.02 94.23,4.02
USBDP: length 119.4
  Top Layer w0.152: v1(92.92,2.92) 92.46,3.38 81.36,3.38 78.01,6.73 10.59,6.73 10.11,6.25 v1(9.38,6.25) 8.72,5.59 6.48,5.59 5.06,7.01 v1(4.88,7.01) v1(4.88,8.03)
  Bottom Layer w0.152: v1(92.92,2.92) 93.09,2.75 94.23,2.75 ; NOREF#6.43 9.72,25.65 10.78,24.59 10.78,22.46 6.46,18.14 6.46,15.37 5.75,14.66 5.75,12.78 9.38,9.15 v1(9.38,6.25) ; v1(4.88,7.01) 5.91,7.01 USB2.A6 ; USB2.B6 4.9,8.02 v1(4.88,8.03)
VON: length 4.8
  Bottom Layer w0.381: NOREF#8.2 56.15,25.04 L3.2
VOP: length 4.5
  Bottom Layer w0.381: L4.2 47.23,25.06 NOREF#9.1
VSYS: length 65.3
  Top Layer w0.381: SW111.3 5.4,24.84 13.44,16.79 17.28,16.79 21.67,12.4
  Top Layer w0.508: v1(21.47,5.62) 26.3,5.62 v1(27.55,4.36) v1(28.05,3.86) v1(28.48,3.43) 30.16,3.43 31.6,4.88 47.43,4.88 49.28,3.02 v1(50.76,3.02) v1(51.42,3.02) v1(52.18,3.02)
  Bottom Layer w0.508: v1(21.47,5.62) 21.47,8.29 21.68,8.5 D1.1 v1(21.68,12.44) 21.68,13.17 21.45,13.4
VUSB: length 80.1
  Top Layer w0.508: 4.05,8.46 4.05,6.07 5.26,4.85 v1(7.32,4.85) ; 4.05,8.46 4.89,9.31 6.72,9.31 v1(7.17,9.76) ; 4.05,8.46 3.08,9.43 3.08,12.98 3.84,13.74 3.84,16.72 v1(6.05,18.92) v1(6.48,19.35) v1(6.89,19.76)
  Bottom Layer w0.254: 6.68,4.72 6.33,4.72 ; U1.4 28.76,18.21 31.2,20.65 31.2,25.48 LED1.1 ; USB2.A9 7.11,9.82 v1(7.17,9.76) 6.93,9.52 USB2.B4 ; 6.71,5.02 6.33,5.02
  Bottom Layer w0.305: 6.71,5.02 7.16,5.02 v1(7.32,4.85) 7.19,4.72 6.68,4.72
  Bottom Layer w0.508: NOREF#4.42 7.18,20.05 v1(6.89,19.76) v1(6.48,19.35) 6.05,18.92 ; 19.32,9.87 18.75,10.43 18.75,11.43 19.56,12.23 Q1.1 ; v1(7.32,4.85) 7.98,5.51 19.45,5.51 R13.1 19.51,9.09 D1.2 19.33,9.73 ; U1.4 25.62,16.71 C11.2 25.52,15.99 24.98,15.44 20.51,15.44 19.56,14.5 19.56,13.44
$1N48640: length 1.7
  Bottom Layer w0.508: R208.2 23.72,18.26 U1.5
$1N76182: length 1.8
  Bottom Layer w0.508: R16.1 23.72,20.76 U1.1
$1N95276: length 3
  Bottom Layer w0.508: R202.2 R201.2 73.68,7.09 Q200.1
$1N109191: length 2.4
  Bottom Layer w0.203: U15.2 52.45,17.51 R43.1
$1N109209: length 2.1
  Bottom Layer w0.203: L3.1 51.96,23.24 U15.10
$1N109210: length 2.2
  Bottom Layer w0.203: L4.1 51.46,23.06 U15.9
$1N112073: length 17.5
  Top Layer w0.254: v1(21.22,22.28) v1(32.01,22.28)
  Bottom Layer w0.254: LED1.2 33.25,25.83 32.65,25.83 32.01,25.2 v1(32.01,22.28) ; R16.2 21.99,22.28 v1(21.22,22.28)
$1N122714: length 4.5
  Bottom Layer w0.254: 66.68,10.49 66.68,11.17 66.91,11.41 67.65,11.41 68.31,12.07 69.53,12.07 R207.2
$1N122760: length 5
  Bottom Layer w0.254: 40.68,10.49 40.68,11.28 41.05,11.66 42.25,11.66 42.88,11.03 R206.2
$1N122794: length 2.7
  Bottom Layer w0.254: 14.68,10.47 14.68,11.27 15.42,12.01 16.07,12.01 R205.2
$1N143787: length 108
  Top Layer w0.254: SW111.2 6.41,22.84 7.88,21.36 7.88,19.46 4.83,16.41 4.83,13.95 7.14,11.63 ; R214.2 75.19,14.48 72.58,11.86 27.49,11.86 27.21,11.58 14.89,11.58 14.41,12.07 13.62,12.07 13.19,11.63 7.14,11.63 ; v1(24.65,7.52) 12.3,7.52 12.17,7.39 10.93,7.39 7.14,11.18 7.14,11.63
  Bottom Layer w0.254: v1(24.65,7.52) 25.14,7.52 U206.1
$1N144439: length 29.3
  Top Layer w0.152: LED2.2 64.85,27.26 64.6,27.51 37.4,27.51 37.17,27.28 LED3.4
$1N144440: length 31.2
  Top Layer w0.152: LED4.4 11.16,26.53 11.16,25.43 12.89,23.7 36.84,23.7 38.85,25.71 LED3.2

## Copper pours and planes (outline as drawn; the poured copper is in the pictures)
GND on Top Layer: -0.98,32.26 101.38,32.26 101.38,-5.74 -0.98,-5.74
GND on Bottom Layer: 17.79,27.71 24.94,27.71 24.94,20.31 17.79,20.31
GND on Bottom Layer: 22.5,11.53 26.48,11.53 26.48,6.3 22.5,6.3
GND on Bottom Layer: 21.01,20.91 28.66,20.91 28.66,18.92 21.01,18.92
GND on Bottom Layer: 47.66,8 49.55,8 49.55,0.71 47.66,0.71
GND on Bottom Layer: -5.76,29.59 108.8,29.59 108.8,-1.75 -5.76,-1.75
GND on Bottom Layer: 22.66,8 32.21,8 32.21,6.1 22.66,6.1
VBAT on Bottom Layer: 25.36,27.69 29.8,27.69 29.8,20.31 25.36,20.31
VCC on Bottom Layer: 22.64,2.31 25.99,2.31 25.99,0.74 22.64,0.74
VCC on Bottom Layer: 30.16,12.5 32.38,12.5 32.38,11 30.16,11
VCC on Bottom Layer: 30.28,13.97 32.38,13.97 32.38,12.17 30.28,12.17
VCC on Bottom Layer: 22.41,13.97 30.83,13.97 30.83,11.82 22.41,11.82
FB2 on Bottom Layer: 23.15,5.84 25.99,5.84 25.99,2.9 23.15,2.9
FB2 on Bottom Layer: 23.14,5.2 24.36,5.2 24.36,3.04 23.14,3.04
NS_N on Bottom Layer: 51.55,8.72 59.93,8.72 59.93,0.36 51.55,0.36
NS_P on Bottom Layer: 42.81,8.72 48.27,8.72 48.27,0.38 42.81,0.38
VSYS on Bottom Layer: 50.27,8.36 52.41,8.36 52.41,0.84 50.27,0.84
VSYS on Bottom Layer: 26.52,5.87 31.66,5.87 31.66,2.21 26.52,2.21
VUSB on Bottom Layer: 25.38,18.67 26.61,18.67 26.61,16.22 25.38,16.22
$1N130028 on Bottom Layer: 26.84,10.39 30.83,10.39 30.83,7.04 26.84,7.04

Small or netless copper shapes (teardrops, artwork), in the pictures only: 1 on Top Layer

## Text on the board
Bottom Silkscreen Layer: sp+ | sp- | speaker | charger | B+ | B- | MAX98357 | NS4168 | JLCJLCJLCJLC | 充电电流：0.423A / 电池需要选择合适 / 自行把控风险 | 5V | D+ | D- | GND | ThreePlus / v2.5
Document Layer: DRC出现usb的2个间距错误不用担心，正常现象 | 板厚 1.6mm
Top Silkscreen Layer: ThreePlus 2.5 | CC BY-NC-SA 4.0 | 20240121 | MakerM0 | OFF | ON
